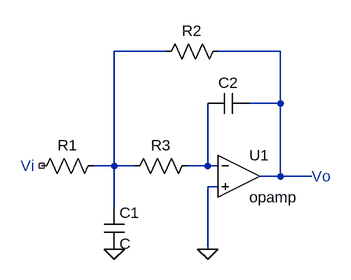
[diagram p0: schematic Draft1.asc]
Draft1.asc, the LTspice schematic file:
Version 4
SHEET 1 880 680
WIRE 192 -32 112 -32
WIRE 368 -32 272 -32
WIRE 368 48 368 -32
WIRE 368 48 320 48
WIRE 112 144 112 -32
WIRE 112 144 80 144
WIRE 144 144 112 144
WIRE 256 144 256 48
WIRE 256 144 224 144
WIRE 272 144 256 144
WIRE 368 160 368 48
WIRE 368 160 336 160
WIRE 416 160 368 160
WIRE 272 176 256 176
WIRE 112 208 112 144
WIRE 256 272 256 176
FLAG 256 272 0
FLAG 112 272 0
SYMBOL res 96 128 R90
WINDOW 0 0 56 VBottom 2
WINDOW 3 32 56 VTop 2
SYMATTR InstName R1
SYMATTR Value ""
SYMBOL res 176 -16 R270
WINDOW 0 32 56 VTop 2
WINDOW 3 0 56 VBottom 2
SYMATTR InstName R2
SYMATTR Value ""
SYMBOL res 128 160 R270
WINDOW 0 32 56 VTop 2
WINDOW 3 0 56 VBottom 2
SYMATTR InstName R3
SYMATTR Value ""
SYMBOL OpAmps\\opamp 304 96 R0
SYMATTR InstName U1
SYMBOL cap 96 208 R0
SYMATTR InstName C1
SYMBOL cap 320 32 R90
WINDOW 0 0 32 VBottom 2
WINDOW 3 32 32 VTop 2
SYMATTR InstName C2
SYMATTR Value ""
TEXT -32 144 Left 2 ;Vi
TEXT 416 160 Left 2 ;Vo

The netlist it stands for:
* Draft1.asc
R1 N001 NC_01
R2 N001 N002
R3 N001 N003
XU1 N003 0 N002 opamp Aol=100K GBW=10Meg  ; pins invin noninvin out
C1 N001 0 C
C2 N002 N003
* Vi
* Vo
.backanno
.end